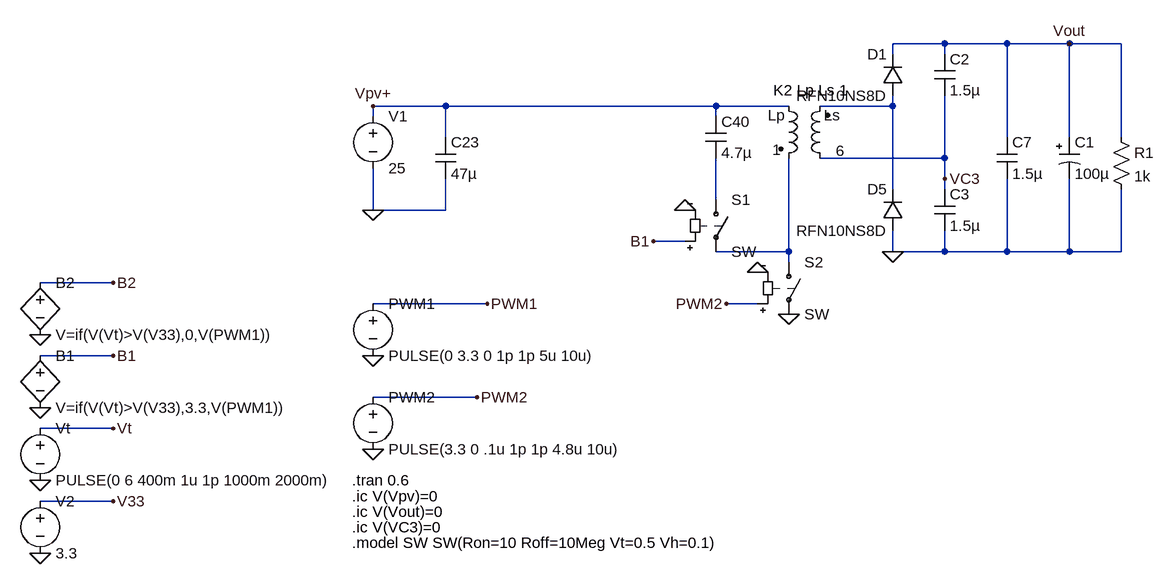
[diagram p0: schematic DC-DC.asc]
DC-DC.asc, the LTspice schematic file:
Version 4
SHEET 1 1828 852
WIRE 992 0 912 0
WIRE 1088 0 992 0
WIRE 1184 0 1088 0
WIRE 1264 0 1184 0
WIRE 912 16 912 0
WIRE 992 16 992 0
WIRE 224 96 112 96
WIRE 640 96 224 96
WIRE 752 96 640 96
WIRE 912 96 912 80
WIRE 912 96 800 96
WIRE 112 112 112 96
WIRE 640 112 640 96
WIRE 224 144 224 96
WIRE 1088 144 1088 0
WIRE 1184 144 1184 0
WIRE 1264 144 1264 0
WIRE 992 176 992 80
WIRE 992 176 800 176
WIRE 992 208 992 176
WIRE 912 224 912 96
WIRE 992 224 992 208
WIRE 640 240 640 176
WIRE 112 256 112 192
WIRE 224 256 224 208
WIRE 224 256 112 256
WIRE 592 304 544 304
WIRE 752 320 752 176
WIRE 752 320 640 320
WIRE 912 320 912 288
WIRE 992 320 992 288
WIRE 992 320 912 320
WIRE 1088 320 1088 208
WIRE 1088 320 992 320
WIRE 1184 320 1184 208
WIRE 1184 320 1088 320
WIRE 1264 320 1264 224
WIRE 1264 320 1184 320
WIRE 752 336 752 320
WIRE -288 368 -400 368
WIRE 288 400 112 400
WIRE 704 400 656 400
WIRE -288 480 -400 480
WIRE 272 544 112 544
WIRE -288 592 -400 592
WIRE -288 704 -400 704
FLAG 752 416 0
FLAG 656 400 PWM2
FLAG 112 256 0
FLAG 112 480 0
FLAG 112 624 0
FLAG 288 400 PWM1
FLAG 272 544 PWM2
FLAG 912 320 0
FLAG 112 96 Vpv+
FLAG 1184 0 Vout
FLAG 992 208 VC3
FLAG -400 560 0
FLAG -400 672 0
FLAG -288 592 Vt
FLAG -288 480 B1
FLAG -400 784 0
FLAG -288 704 V33
FLAG -400 448 0
FLAG -288 368 B2
FLAG 592 256 0
FLAG 704 352 0
FLAG 544 304 B1
SYMBOL voltage 112 96 R0
WINDOW 123 0 0 Left 0
WINDOW 39 0 0 Left 0
SYMATTR InstName V1
SYMATTR Value 25
SYMBOL cap 208 144 R0
SYMATTR InstName C23
SYMATTR Value 47µ
SYMBOL cap 624 112 R0
SYMATTR InstName C40
SYMATTR Value 4.7µ
SYMBOL ind2 736 80 R0
WINDOW 0 70 30 Left 2
WINDOW 3 -9 83 Left 2
SYMATTR InstName Ls
SYMATTR Value 1
SYMATTR Type ind
SYMBOL ind2 816 192 R180
WINDOW 0 69 82 Left 2
WINDOW 3 -22 27 Left 2
SYMATTR InstName Lp
SYMATTR Value 6
SYMATTR Type ind
SYMBOL diode 928 80 R180
WINDOW 0 24 64 Left 2
WINDOW 3 24 0 Left 2
SYMATTR InstName D1
SYMATTR Value RFN10NS8D
SYMATTR Description Zener Diode
SYMATTR Type zener
SYMBOL diode 928 288 R180
WINDOW 0 24 64 Left 2
WINDOW 3 24 0 Left 2
SYMATTR InstName D5
SYMATTR Value RFN10NS8D
SYMATTR Description Zener Diode
SYMATTR Type zener
SYMBOL cap 976 16 R0
SYMATTR InstName C2
SYMATTR Value 1.5µ
SYMBOL cap 976 224 R0
SYMATTR InstName C3
SYMATTR Value 1.5µ
SYMBOL cap 1072 144 R0
SYMATTR InstName C7
SYMATTR Value 1.5µ
SYMBOL polcap 1168 144 R0
SYMATTR InstName C1
SYMATTR Value 100µ
SYMBOL voltage 112 384 R0
WINDOW 123 0 0 Left 0
WINDOW 39 24 124 Left 2
SYMATTR InstName PWM1
SYMATTR Value PULSE(0 3.3 0 1p 1p 5u 10u)
SYMBOL voltage 112 528 R0
WINDOW 123 0 0 Left 0
WINDOW 39 24 124 Left 2
SYMATTR InstName PWM2
SYMATTR Value PULSE(3.3 0 .1u 1p 1p 4.8u 10u)
SYMBOL bv -400 464 R0
SYMATTR InstName B1
SYMATTR Value V=if(V(Vt)>V(V33),3.3,V(PWM1))
SYMBOL voltage -400 576 R0
WINDOW 123 0 0 Left 0
WINDOW 39 0 0 Left 0
SYMATTR InstName Vt
SYMATTR Value PULSE(0 6 400m 1u 1p 1000m 2000m)
SYMBOL voltage -400 688 R0
WINDOW 123 0 0 Left 0
WINDOW 39 0 0 Left 0
SYMATTR InstName V2
SYMATTR Value 3.3
SYMBOL bv -400 352 R0
SYMATTR InstName B2
SYMATTR Value V=if(V(Vt)>V(V33),0,V(PWM1))
SYMBOL res 1248 128 R0
SYMATTR InstName R1
SYMATTR Value 1k
SYMBOL sw 640 224 R0
SYMATTR InstName S1
SYMBOL sw 752 320 R0
SYMATTR InstName S2
TEXT 728 72 Left 2 !K2 Lp Ls 1
TEXT 80 672 Left 2 !.tran 0.6
TEXT 80 696 Left 2 !.ic V(Vpv)=0
TEXT 80 720 Left 2 !.ic V(Vout)=0
TEXT 80 744 Left 2 !.ic V(VC3)=0
TEXT 80 768 Left 2 !.model SW SW(Ron=10 Roff=10Meg Vt=0.5 Vh=0.1)

The netlist it stands for:
* DC-DC.asc
V1 Vpv+ 0 25
C23 Vpv+ 0 47µ
C40 Vpv+ N002 4.7µ
Ls Vpv+ N003 1
Lp VC3 N001 6
D1 N001 Vout RFN10NS8D
D5 0 N001 RFN10NS8D
C2 Vout VC3 1.5µ
C3 VC3 0 1.5µ
C7 Vout 0 1.5µ
C1 Vout 0 100µ
V§PWM1 PWM1 0 PULSE(0 3.3 0 1p 1p 5u 10u)
V§PWM2 PWM2 0 PULSE(3.3 0 .1u 1p 1p 4.8u 10u)
B1 B1 0 V=if(V(Vt)>V(V33),3.3,V(PWM1))
Vt Vt 0 PULSE(0 6 400m 1u 1p 1000m 2000m)
V2 V33 0 3.3
B2 B2 0 V=if(V(Vt)>V(V33),0,V(PWM1))
R1 Vout 0 1k
S1 N002 N003 B1 0 SW
S2 N003 0 PWM2 0 SW
.model D D
.lib standard.dio
K2 Lp Ls 1
.tran 0.6
.ic V(Vpv)=0
.ic V(Vout)=0
.ic V(VC3)=0
.model SW SW(Ron=10 Roff=10Meg Vt=0.5 Vh=0.1)
.backanno
.end